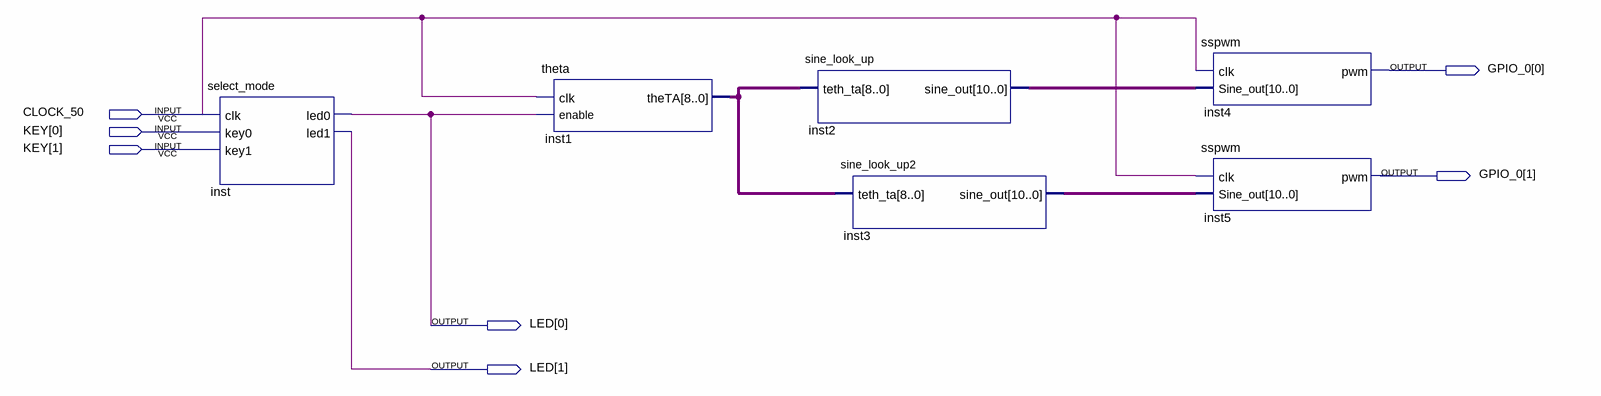
[diagram p0: schematic sheet]
// Quartus schematic test.bdf as structural Verilog: 6 symbols, 7 pins
module test (
  input  CLOCK_50,
  input  [1:0] KEY,
  output [1:0] GPIO_0,
  output [1:0] LED
);

  wire [8:0] inst1_theta;
  wire [10:0] inst2_sine_out, inst3_sine_out;

  select_mode inst (.clk(CLOCK_50), .key0(KEY[0]), .key1(KEY[1]), .led0(LED[0]), .led1(LED[1]));
  theta inst1 (.clk(CLOCK_50), .enable(LED[0]), .theTA(inst1_theta));
  sine_look_up inst2 (.teth_ta(inst1_theta), .sine_out(inst2_sine_out));
  sine_look_up2 inst3 (.teth_ta(inst1_theta), .sine_out(inst3_sine_out));
  sspwm inst4 (.clk(CLOCK_50), .Sine_out(inst2_sine_out), .pwm(GPIO_0[0]));
  sspwm inst5 (.clk(CLOCK_50), .Sine_out(inst3_sine_out));  // open: pwm
endmodule
